# Altium schematic sheet MicroController.SchDoc
size A3; SheetNumber: 4; SheetTotal: 4
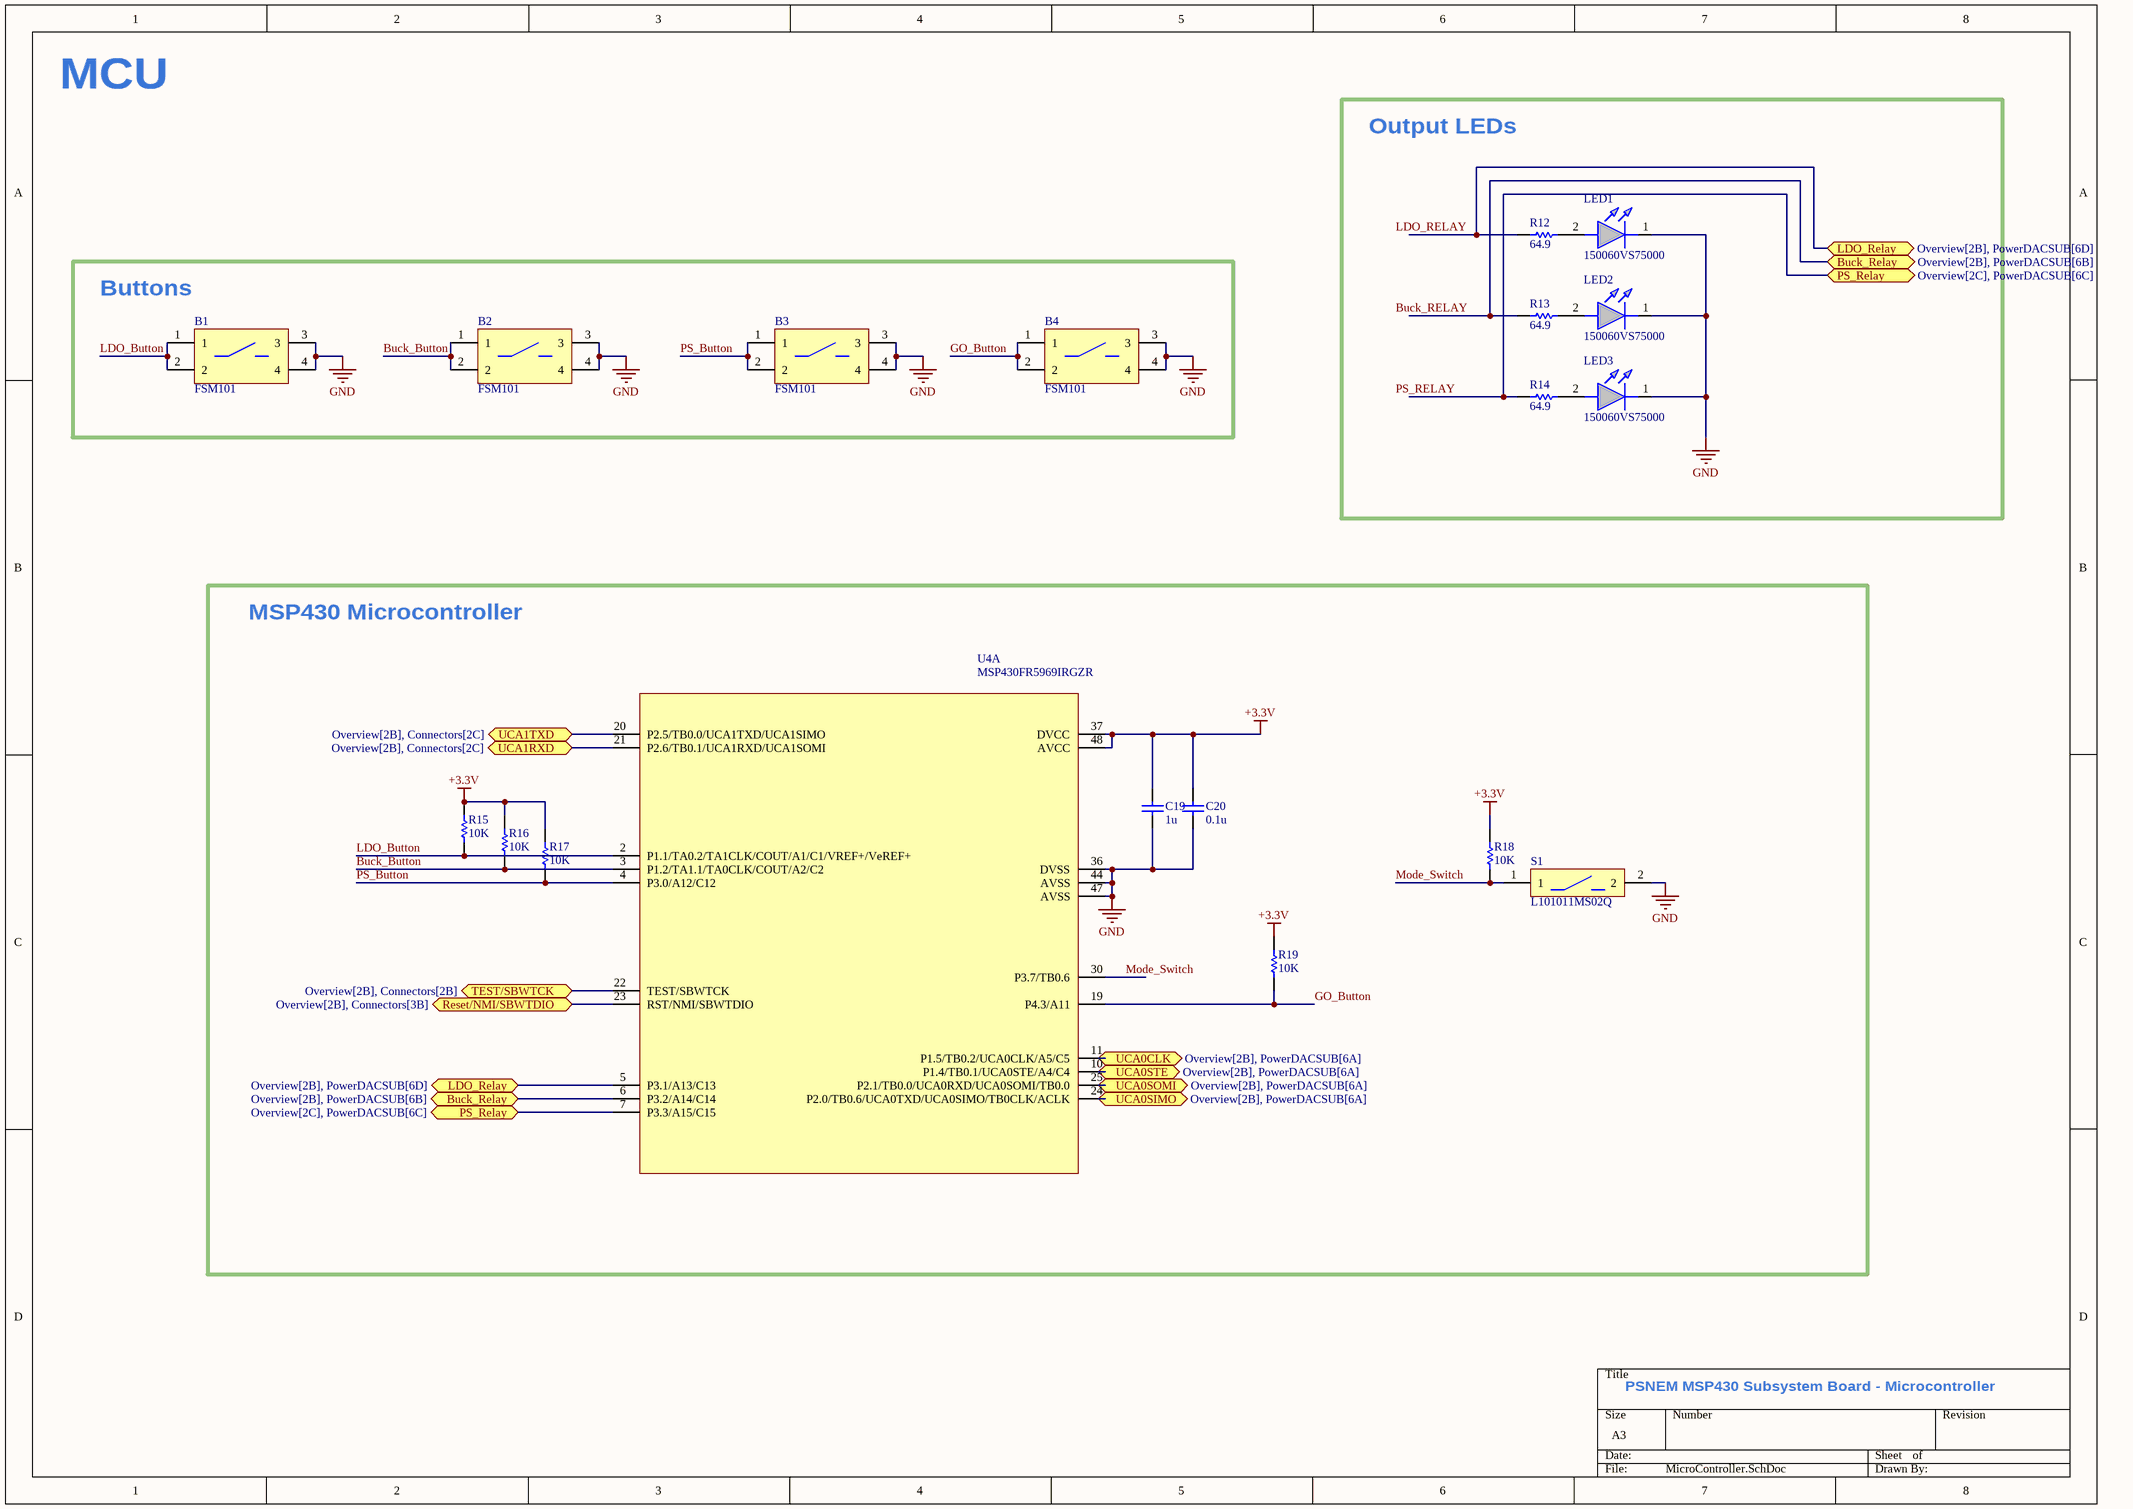
[diagram p0: MicroController.SchDoc]

## Parts
B1  FSM101  [FSM101]
B2  FSM101  [FSM101]
B3  FSM101  [FSM101]
B4  FSM101  [FSM101]
C19  1u  [0805 Cap]
C20  0.1u  [0805 Cap]
LED1  150060VS75000  [150060VS75000]
LED2  150060VS75000  [150060VS75000]
LED3  150060VS75000  [150060VS75000]
R12  64.9  [RESC1608X06N]
R13  64.9  [RESC1608X06N]
R14  64.9  [RESC1608X06N]
R15  10K  [RESC1608X06N]
R16  10K  [RESC1608X06N]
R17  10K  [RESC1608X06N]
R18  10K  [RESC1608X06N]
R19  10K  [RESC1608X06N]
S1  L101011MS02Q  [L101011MS02Q]
U4  MSP430FR5969IRGZR  [MSP430FR5969IRGZR]  (part A of 2)

## Blocks framed on the sheet
Output LEDs: LED1-LED3 R12-R14
Buttons: B1-B4
MSP430 Microcontroller: C19 C20 R15-R19 S1 U4

## Ports
Buck_Relay (bidir, see Overview[2B], PowerDACSUB[6B]), LDO_Relay (bidir, see Overview[2B], PowerDACSUB[6D]), PS_Relay (bidir, see Overview[2C], PowerDACSUB[6C]), Reset/NMI/SBWTDIO (bidir, see Overview[2B], Connectors[3B]), TEST/SBWTCK (bidir, see Overview[2B], Connectors[2B]), UCA0CLK (bidir, see Overview[2B], PowerDACSUB[6A]), UCA0SIMO (bidir, see Overview[2B], PowerDACSUB[6A]), UCA0SOMI (bidir, see Overview[2B], PowerDACSUB[6A]), UCA0STE (bidir, see Overview[2B], PowerDACSUB[6A]), UCA1RXD (bidir, see Overview[2B], Connectors[2C]), UCA1TXD (bidir, see Overview[2B], Connectors[2C])

## Nets
+3.3V: C19.2 C20.2 R15.2 R16.2 R17.2 R18.2 R19.2 U4.37(DVCC) U4.48(AVCC)
GND: B1.3 B1.4 B2.3 B2.4 B3.3 B3.4 B4.3 B4.4 C19.1 C20.1 LED1.1(K) LED2.1(K) LED3.1(K) S1.2 U4.36(DVSS) U4.44(AVSS) U4.47(AVSS)
Buck_Button: B2.1 B2.2 R16.1 U4.3(P1.2/TA1.1/TA0CLK/COUT/A2/C2)
Buck_Relay: R13.1 U4.6(P3.2/A14/C14) ; port Buck_Relay
GO_Button: B4.1 B4.2 R19.1 U4.19(P4.3/A11)
LDO_Button: B1.1 B1.2 R15.1 U4.2(P1.1/TA0.2/TA1CLK/COUT/A1/C1/VREF+/VeREF+)
LDO_Relay: R12.1 U4.5(P3.1/A13/C13) ; port LDO_Relay
Mode_Switch: R18.1 S1.1 U4.30(P3.7/TB0.6)
PS_Button: B3.1 B3.2 R17.1 U4.4(P3.0/A12/C12)
PS_Relay: R14.1 U4.7(P3.3/A15/C15) ; port PS_Relay
Reset/NMI/SBWTDIO: U4.23(RST/NMI/SBWTDIO) ; port Reset/NMI/SBWTDIO
TEST/SBWTCK: U4.22(TEST/SBWTCK) ; port TEST/SBWTCK
UCA0CLK: U4.11(P1.5/TB0.2/UCA0CLK/A5/C5) ; port UCA0CLK
UCA0SIMO: U4.24(P2.0/TB0.6/UCA0TXD/UCA0SIMO/TB0CLK/ACLK) ; port UCA0SIMO
UCA0SOMI: U4.25(P2.1/TB0.0/UCA0RXD/UCA0SOMI/TB0.0) ; port UCA0SOMI
UCA0STE: U4.10(P1.4/TB0.1/UCA0STE/A4/C4) ; port UCA0STE
UCA1RXD: U4.21(P2.6/TB0.1/UCA1RXD/UCA1SOMI) ; port UCA1RXD
UCA1TXD: U4.20(P2.5/TB0.0/UCA1TXD/UCA1SIMO) ; port UCA1TXD
NetLED1_2: LED1.2(A) R12.2
NetLED2_2: LED2.2(A) R13.2
NetLED3_2: LED3.2(A) R14.2

## Notes on the sheet
- MCU
- PSNEM MSP430 Subsystem Board - Microcontroller
- Labels drawn without touching a wire or pin: Buck_RELAY, LDO_RELAY, PS_RELAY

## Library data of the parts
B1-B4 = FSM101: Tactile Switch SPST-NO Top Actuated Through Hole
C19 = CC0805KKX7R7BB105: 1 µF ±10% 16V Ceramic Capacitor X7R 0805 (2012 Metric); value: 1u
C20 = CC0805KRX7R9BB104: 0.1 µF ±10% 50V Ceramic Capacitor X7R 0805 (2012 Metric); value: 0.1u
LED1-LED3 = 150060VS75000: LED GREEN CLEAR 0603 SMD
R12-R14 = ERA-3AEB64R9V: Thin Film Resistors - SMD 0603 64.9ohm 0.1% 25ppm; value: 64.9
R15-R19 = CRCW060310K0FKEAHP: RES SMD 10K OHM 1% 1/3W 0603; value: 10K
S1 = L101011MS02Q: SWITCH SLIDE SPST 4A 125V
U4 = MSP430FR5969IRGZR: MSP430 CPUXV2 MSP430™ FRAM Microcontroller IC 16-Bit 16MHz 64KB (64K x 8) FRAM 48-VQFN (7x7)